# EAGLE design RH030.2 (EAGLE 7.1.0)
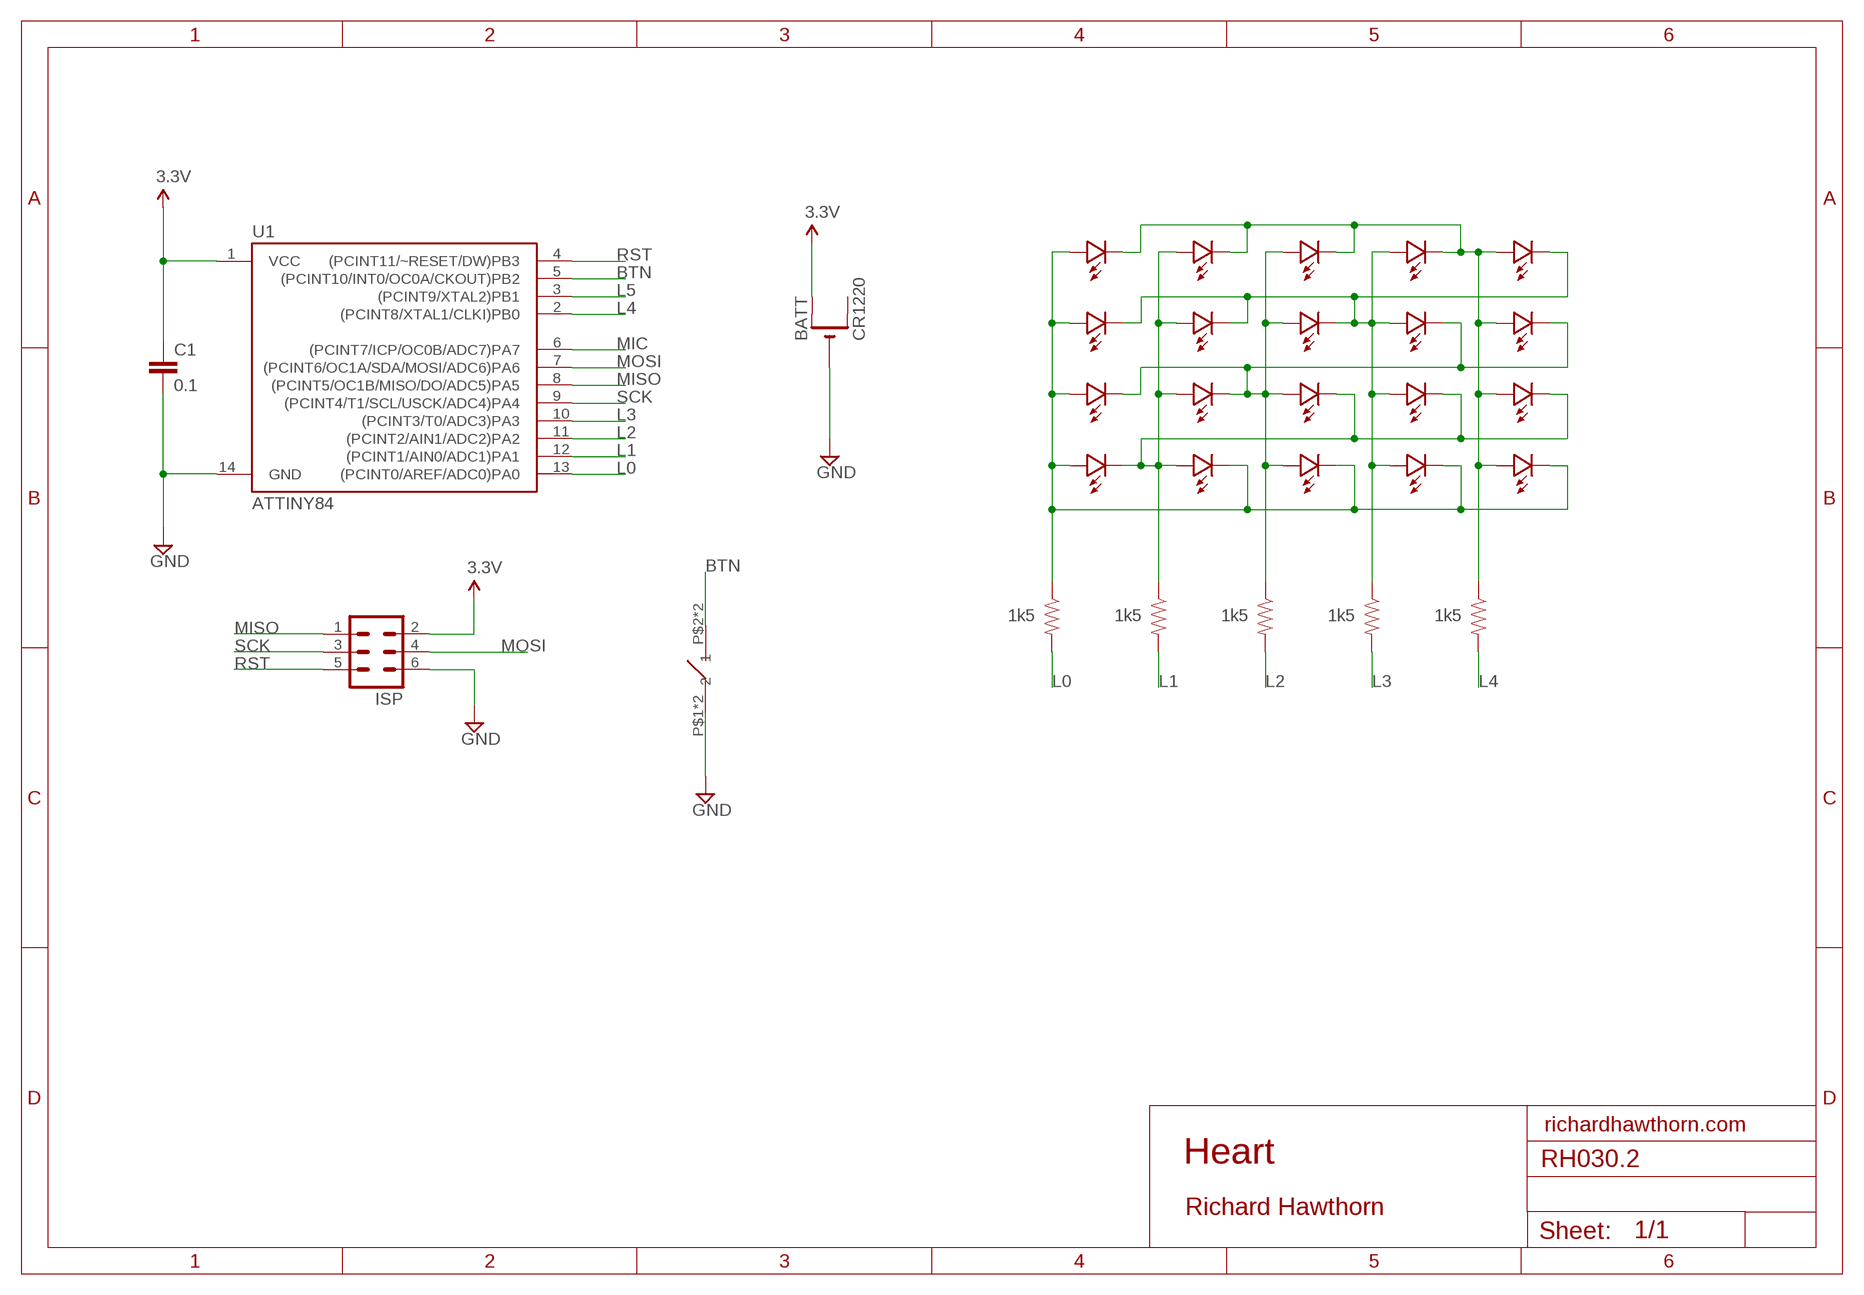
[diagram p0: schematic, sheet 1]

## Parts
BATT  CR1220  CR1220SMT  [CR1220-SMD]
BTN1  TURTLE-3PIN  [TURTLE-3PIN]
C1  0.1  CAP0603-CAP  [0603-CAP]
ISP  MA03-2  [MA03-2]
LED1  LED0603  [0603-LED]
LED2  LED0603  [0603-LED]
LED3  LED0603  [0603-LED]
LED4  LED0603  [0603-LED]
LED5  LED0603  [0603-LED]
LED6  LED0603  [0603-LED]
LED7  LED0603  [0603-LED]
LED8  LED0603  [0603-LED]
LED9  LED0603  [0603-LED]
LED10  LED0603  [0603-LED]
LED11  LED0603  [0603-LED]
LED12  LED0603  [0603-LED]
LED13  LED0603  [0603-LED]
LED14  LED0603  [0603-LED]
LED15  LED0603  [0603-LED]
LED16  LED0603  [0603-LED]
LED17  LED0603  [0603-LED]
LED18  LED0603  [0603-LED]
LED19  LED0603  [0603-LED]
LED20  LED0603  [0603-LED]
R1  1k5  RESISTOR0603-RES  [0603-RES]
R2  1k5  RESISTOR0603-RES  [0603-RES]
R3  1k5  RESISTOR0603-RES  [0603-RES]
R4  1k5  RESISTOR0603-RES  [0603-RES]
R5  1k5  RESISTOR0603-RES  [0603-RES]
U1  ATTINY84  [SO14]

## Nets
BTN: BTN1.P$2 BTN1.P$4 U1.5((PCINT10/INT0/OC0A/CKOUT)PB2)
GND [power]: BATT.- BTN1.P$1 BTN1.P$3 C1.2 ISP.6 U1.14(GND)
L0: R1.2 U1.13((PCINT0/AREF/ADC0)PA0)
L1: R2.2 U1.12((PCINT1/AIN0/ADC1)PA1)
L2: R3.2 U1.11((PCINT2/AIN1/ADC2)PA2)
L3: R4.2 U1.10((PCINT3/T0/ADC3)PA3)
L4: R5.2 U1.2((PCINT8/XTAL1/CLKI)PB0)
L5: U1.3((PCINT9/XTAL2)PB1)
MIC: U1.6((PCINT7/ICP/OC0B/ADC7)PA7)
MISO: ISP.1 U1.8((PCINT5/OC1B/MISO/DO/ADC5)PA5)
MOSI: ISP.4 U1.7((PCINT6/OC1A/SDA/MOSI/ADC6)PA6)
N$12: LED2.PLUS LED7.PLUS LED12.PLUS LED13.MINUS LED14.MINUS LED15.MINUS LED16.MINUS LED17.PLUS R2.1
N$22: LED1.PLUS LED6.PLUS LED11.PLUS LED16.PLUS LED17.MINUS LED18.MINUS LED19.MINUS LED20.MINUS R1.1
N$32: LED1.MINUS LED2.MINUS LED3.MINUS LED4.MINUS LED5.PLUS LED10.PLUS LED15.PLUS LED20.PLUS R5.1
N$41: LED4.PLUS LED5.MINUS LED6.MINUS LED7.MINUS LED8.MINUS LED9.PLUS LED14.PLUS LED19.PLUS R4.1
N$50: LED3.PLUS LED8.PLUS LED9.MINUS LED10.MINUS LED11.MINUS LED12.MINUS LED13.PLUS LED18.PLUS R3.1
RST: ISP.5 U1.4((PCINT11/~RESET/DW)PB3)
SCK: ISP.3 U1.9((PCINT4/T1/SCL/USCK/ADC4)PA4)
VCC: BATT.+$1(+) C1.1 ISP.2 U1.1(VCC) ; supply symbol labelled 3.3V
Unconnected: BATT.+$2(+1)

## Notes on the sheet
- richardhawthorn.com
- Heart
- Richard Hawthorn

## Library data of the parts
BATT = adafruit:CR1220: CR1216/CR1220/CR1225 12mm 3V lithium coin cell Great for battery packup. Both SMT and THM holders. Note the THM package has the ground pads on both sides of the PCB so that the masks are the same - this reduces the cost
BTN1 = Richards:TURTLE-3PIN
C1 = LowPowerLab:CAP: Capacitor Standard 0603 ceramic capacitor, and 0.1" leaded capacitor.
ISP = Richards:MA03-2: PIN HEADER; OC_FARNELL: unknown; OC_NEWARK: unknown
LED1-LED20 = LowPowerLab:LED
R1-R5 = LowPowerLab:RESISTOR: Resistor Basic schematic elements and footprints for 0603, 1206, and PTH resistors.
U1 = SparkFun-DigitalIC:ATTINY84: Atmel 14-pin 2/4/8kB flash uC

## Net classes
1 power: width 0.381 mm, clearance 0.254 mm

## Board
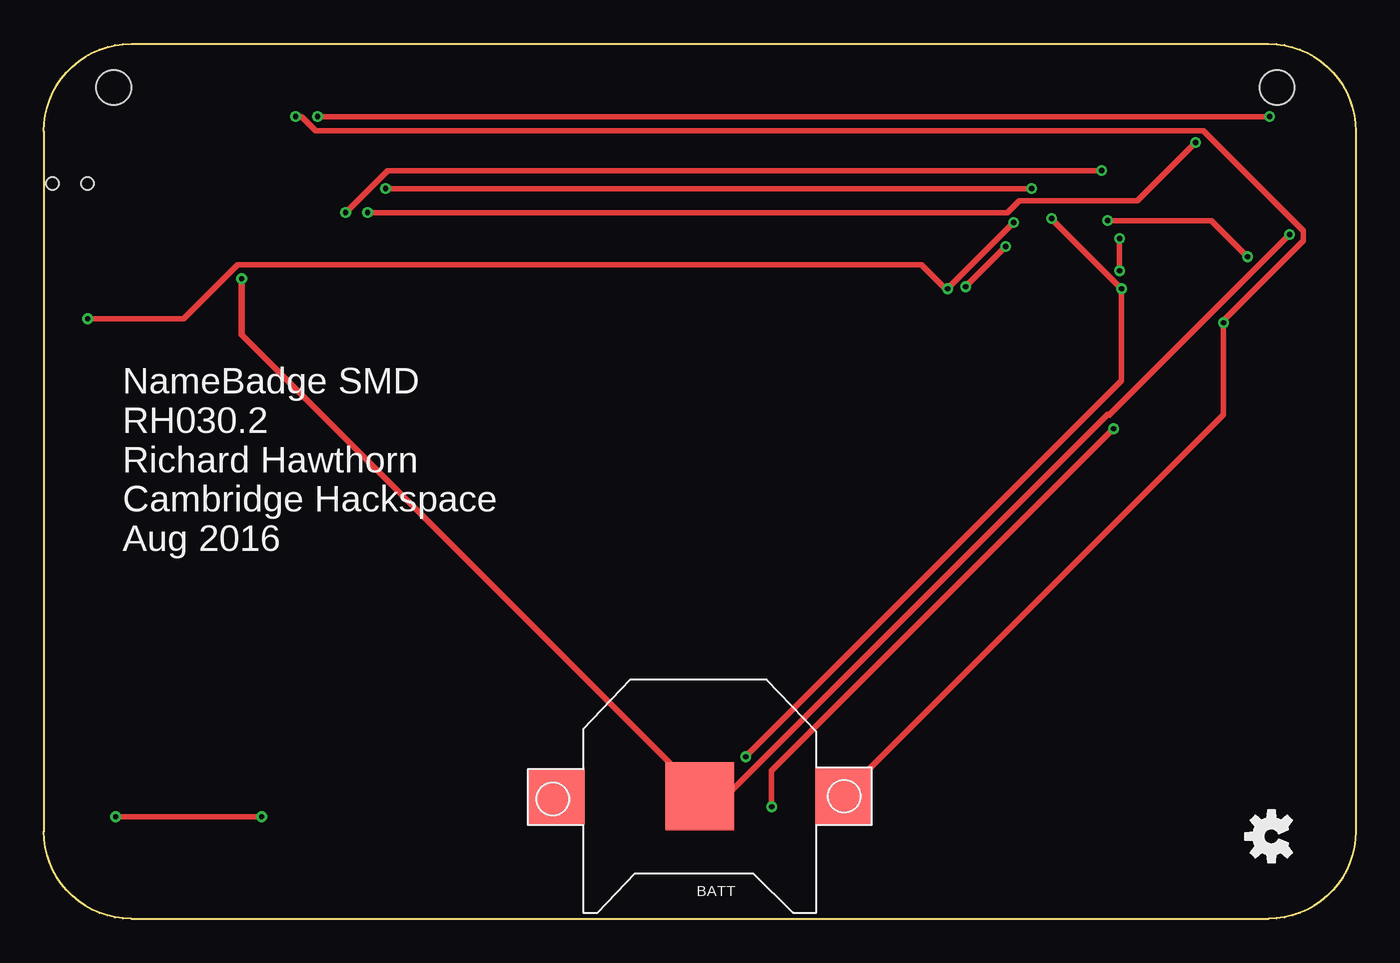
[diagram p1: board, top side]
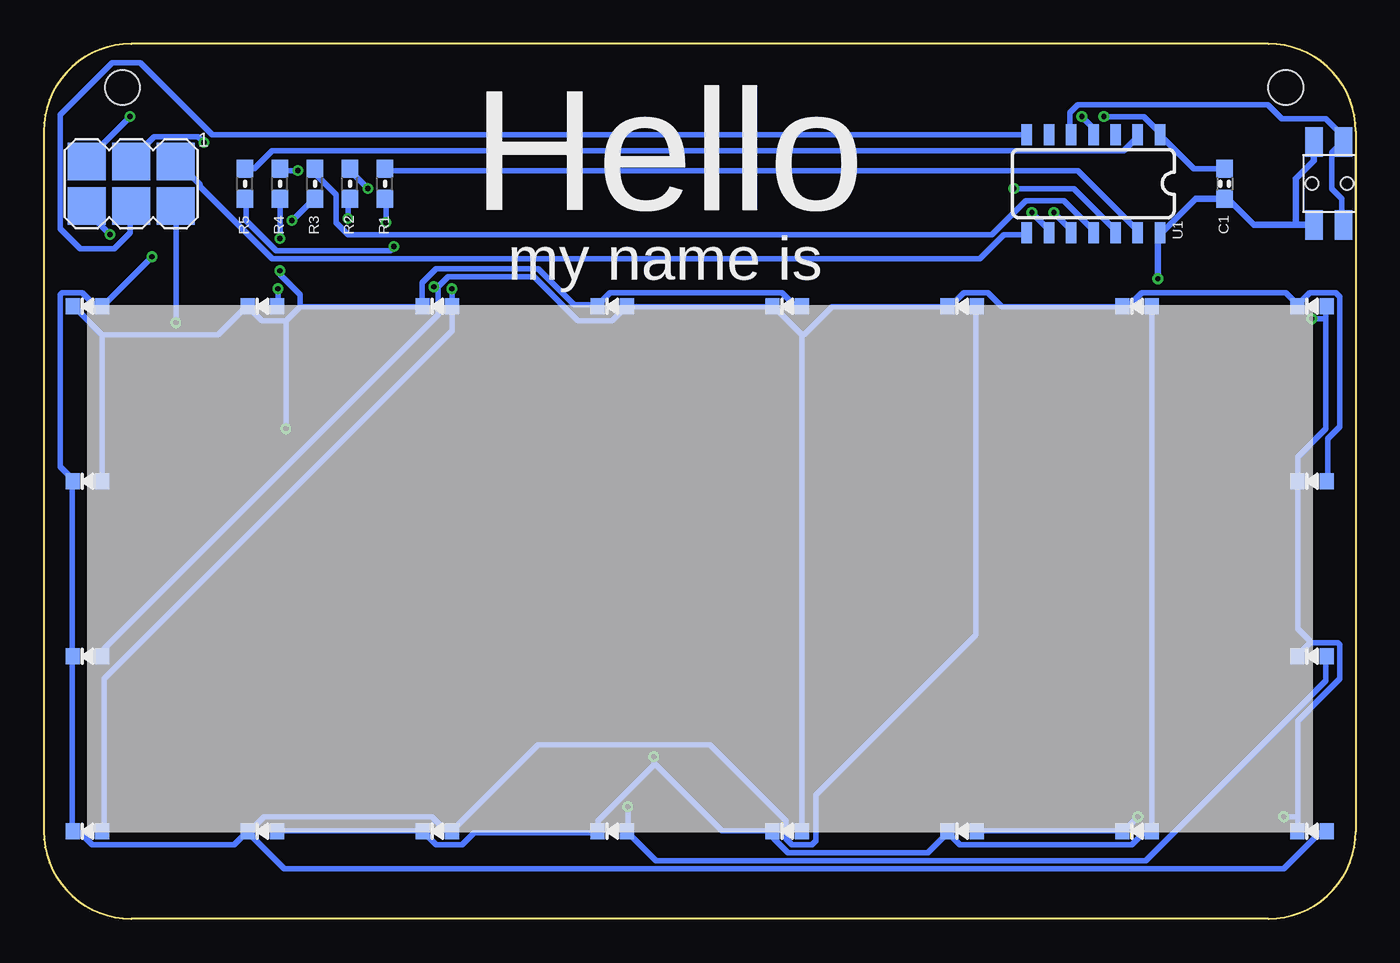
[diagram p2: board, bottom side, seen from below]

Size 75 x 50 mm. Coordinates in mm from the lower left corner, seen from the top.
Outline: 5,50 70,50 arc-90 75,45 75,5 arc-90 70,0 5,0 arc-90 0,5 0,45 arc-90 5,50
Copper layers (1*16): Top 0.035mm / dielectric 1.5mm / Bottom 0.035mm
Design rules "ITEADstudio_DRC *": minimum track width 12mil, minimum drill 12mil, track to track 6mil, track to pad 6mil, pad to pad 6mil, via to via 6mil, smd to smd 0mil, copper to edge 10mil, drill to drill 10mil, minimum pad ring 10mil, minimum via ring 6mil, stop-mask expansion 2mil, vias tented up to drill 100mil, thermal gap 15mil
Holes 2 mm at 4,47.5 70.5,47.5
tRestrict: area 24.3,8.9 to 29.1,12.8; area 5.8,16.9 to 6.9,18.5; area 5.2,9.7 to 6.7,10.4
bRestrict: area 27.4,17.7 to 29.2,18.7; area 21.1,13.8 to 22.9,14.9; area 21.6,12.6 to 22.1,13.2; area 20.7,12.6 to 21.2,13.2; area 20.2,12.8 to 20.7,13.5; area 20.1,13.4 to 20.6,14; area 26.5,18.9 to 27.1,19.5; area 26.5,17.9 to 27.1,18.5; area 27.5,19.1 to 28,19.8; area 27.9,18.8 to 29.1,19.6

### Footprints (pad centres in the part's own frame; a part is rotated, then mirrored left to right if it is on the bottom)
CR1220-SMD = smd 3.2 x 3.2: +$1 -8.2,0; +$2 8.2,0 | smd 3.9 x 3.9: - 0,0
TURTLE-3PIN = smd 1.676 x 1: P$1 -2.39,-0.889; P$2 -2.39,0.811; P$3 2.36,-0.889; P$4 2.36,0.811 | hole 0.75: -0.015,-1; -0.015,1
0603-CAP = smd 1.016 x 0.965: 1 -0.85,0; 2 0.85,0
MA03-2 = smd 2.159 x 2.159: 1 -2.54,-1.27; 2 -2.54,1.27; 3 0,-1.27; 4 0,1.27; 5 2.54,-1.27; 6 2.54,1.27
0603-LED = smd 0.8 x 0.9: MINUS -0.85,0; PLUS 0.85,0
0603-RES = smd 1.016 x 0.965: 1 -0.85,0; 2 0.85,0
SO14 = smd 0.6 x 1.2: 1 -3.81,-2.8; 2 -2.54,-2.8; 3 -1.27,-2.8; 4 0,-2.8; 5 1.27,-2.8; 6 2.54,-2.8; 7 3.81,-2.8; 8 3.81,2.8; 9 2.54,2.8; 10 1.27,2.8; 11 0,2.8; 12 -1.27,2.8; 13 -2.54,2.8; 14 -3.81,2.8

### Placement (x,y rotation side)
BATT  37.5,7 180 top
BTN1  1.5,42 270 bottom
C1  7.5,42 270 bottom
ISP  70,42 180 bottom
LED1  2.5,35 0 bottom
LED2  12.5,35 0 bottom
LED3  22.5,35 0 bottom
LED4  32.5,35 0 bottom
LED5  42.5,35 0 bottom
LED6  52.5,35 0 bottom
LED7  62.5,35 0 bottom
LED8  72.5,35 0 bottom
LED9  72.5,25 0 bottom
LED10  72.5,15 0 bottom
LED11  72.5,5 0 bottom
LED12  62.5,5 0 bottom
LED13  52.5,5 0 bottom
LED14  42.5,5 0 bottom
LED15  32.5,5 0 bottom
LED16  22.5,5 0 bottom
LED17  12.5,5 0 bottom
LED18  2.5,5 0 bottom
LED19  2.5,15 0 bottom
LED20  2.5,25 0 bottom
R1  55.5,42 90 bottom
R2  57.5,42 90 bottom
R3  59.5,42 90 bottom
R4  61.5,42 90 bottom
R5  63.5,42 90 bottom
U1  15,42 180 bottom
U$3  [OSHW-LOGO-S]  70.17,4.71 90 top

### Tracks (layer width: path | path; a pad name or v marks a point on that pad's centre or on a via)
BTN
  Bottom 0.305: BTN1.P$4 0.8,39.66 0.8,41.15 1.37,41.72 1.37,43.78 0.8,44.35 BTN1.P$2 0.91,44.46 0.91,44.92 1.71,45.72 4.23,45.72 5.03,46.52 15.89,46.52 16.34,46.06 16.34,44.81 U1.5
GND  (via drill 0.3)
  Top 0.381: v71.21,39.09 60.92,28.8 60.81,28.8 39.09,7.09 37.6,7.09 BATT.- 37.49,7.2 11.32,33.38 v11.32,36.58
  Bottom 0.381: 3.43,39.66 5.83,39.66 7.32,41.15 C1.2 7.54,41.15 9.14,41.15 11.09,39.2 U1.14 11.32,39.09 v11.32,36.58 | 3.43,39.66 2.4,39.66 BTN1.P$3 | 3.43,39.66 3.43,42.29 2.4,43.32 2.4,44.35 BTN1.P$1 | v71.21,39.09 72.47,40.35 72.47,40.69 ISP.6
L0
  Bottom 0.305: R1.2 55.44,42.75 15.89,42.75 12.57,39.43 12.57,39.2 U1.13
L1  (via drill 0.3)
  Top 0.305: v19.55,41.72 v56.46,41.72
  Bottom 0.305: v56.46,41.72 57.49,42.75 R2.2 | v19.55,41.72 16.12,41.72 13.83,39.43 13.83,39.2 U1.12
L2
  Bottom 0.305: R3.2 59.44,42.75 59.44,42.52 58.29,41.38 58.29,39.78 57.61,39.09 20.8,39.09 18.86,41.03 16.69,41.03 15.09,39.43 15.09,39.2 U1.11
L3  (via drill 0.3)
  Top 0.305: v60.47,42.75 19.66,42.75 v17.26,40.35
  Bottom 0.305: v60.47,42.75 61.49,42.75 R4.2 | v17.26,40.35 16.34,39.43 16.34,39.2 U1.10
L4
  Bottom 0.305: R5.2 63.44,42.86 62.98,42.86 61.95,43.89 13.26,43.89 12.46,44.69 U1.2
MISO
  Bottom 0.305: U1.8 18.86,39.09 20.12,39.09 21.49,37.72 61.95,37.72 66.06,41.83 66.06,41.95 67.44,43.32 ISP.1
MOSI
  Bottom 0.305: U1.7 18.86,44.81 65.38,44.81 69.49,48.92 71.09,48.92 74.07,45.95 74.07,39.43 72.92,38.29 70.98,38.29 70.07,39.2 70.07,40.69 ISP.4
N$12  (via drill 0.3)
  Top 0.305: v57.61,40.01 v61.61,36.01 61.61,30.75 v40.12,9.26
  Bottom 0.305: LED2.PLUS 11.66,34.98 11.66,5.14 LED17.PLUS 11.66,4.92 12.12,4.92 12.8,4.23 22.63,4.23 23.32,4.92 LED16.MINUS 23.43,4.8 24.46,3.77 32.46,3.77 33.26,4.57 33.26,4.92 LED15.MINUS 33.49,5.03 36.23,5.03 40.01,8.8 40.12,8.8 | v61.61,36.01 61.61,35.09 LED7.PLUS | v57.61,40.01 57.61,41.15 R2.1 | LED12.PLUS 61.61,5.03 53.49,5.03 LED13.MINUS 53.26,4.92 52.58,4.23 51.09,4.23 50.41,4.92 43.43,4.92 LED14.MINUS 43.32,5.14 43.32,5.6 40.12,8.8 | 40.12,8.8 v40.12,9.26
N$22  (via drill 0.3)
  Top 0.305: v4.12,5.83 v12.46,5.83 | v55.44,39.78 v51.66,36.01 51.55,36.01 50.18,37.38 11.09,37.38 8,34.29 v2.52,34.29
  Bottom 0.305: LED16.PLUS 21.6,5.03 13.37,5.03 LED17.MINUS 13.26,5.03 v12.46,5.83 | 3.31,5.83 3.31,11.32 0.91,13.72 0.91,15.66 1.03,15.77 2.63,15.77 | 3.31,5.83 3.31,5.03 LED18.MINUS | 2.63,15.77 3.31,15.09 LED19.MINUS | 2.63,15.77 2.63,15.89 3.31,16.57 3.31,24.92 LED20.MINUS 3.31,25.15 3.31,26.4 1.71,28 1.71,34.29 | 1.71,34.29 1.71,34.98 LED1.PLUS | 3.31,5.83 v4.12,5.83 | LED11.PLUS 71.55,5.03 71.55,13.72 51.66,33.6 51.66,34.98 LED6.PLUS 51.66,35.09 v51.66,36.01 | v55.44,39.78 55.44,41.15 R1.1 | v2.52,34.29 1.71,34.29
N$32  (via drill 0.3)
  Top 0.305: v52.69,36.12 v54.98,38.41
  Bottom 0.305: LED20.PLUS 1.6,25.03 1.6,27.43 0.91,28.12 0.91,35.55 1.14,35.78 2.63,35.78 3.31,35.09 LED1.MINUS 3.43,35.2 4,35.78 12.23,35.78 12.92,35.09 13.26,35.09 LED2.MINUS 13.49,34.98 20.23,34.98 21.03,35.78 22.4,35.78 23.2,34.98 LED3.MINUS 23.43,34.98 29.95,34.98 31.55,33.38 31.66,33.38 | 31.66,33.38 31.66,5.03 LED15.PLUS | 31.66,33.38 33.26,34.98 LED4.MINUS 33.49,34.98 41.6,34.98 LED5.PLUS 41.72,34.98 42.52,34.18 44.46,34.18 46.98,36.69 51.89,36.69 52.46,36.12 | 52.46,36.12 52.46,34.52 71.55,15.43 71.55,15.09 LED10.PLUS | v54.98,38.41 55.21,38.18 61.72,38.18 63.44,39.89 63.44,41.15 R5.1 | v52.69,36.12 52.46,36.12
N$41  (via drill 0.3)
  Top 0.305: v61.49,37.03 v61.49,38.86 | v41.6,6.4 41.6,8.46 v61.15,28
  Bottom 0.305: LED19.PLUS 1.71,14.97 1.71,13.6 12,3.31 40.01,3.31 41.6,4.92 LED14.PLUS 41.6,5.14 v41.6,6.4 | LED4.PLUS 31.66,35.09 32.12,35.09 32.8,35.78 42.63,35.78 43.32,35.09 LED5.MINUS 43.43,35.09 44.69,35.09 46.75,37.15 52.58,37.15 53.38,36.35 53.38,35.09 LED6.MINUS 53.38,34.98 60.35,34.98 | 71.67,33.38 71.67,25.03 LED9.PLUS | 71.67,33.38 73.27,34.98 LED8.MINUS | 61.15,34.18 60.35,34.98 | 61.15,34.18 62.52,34.18 63.32,34.98 LED7.MINUS 63.44,34.98 65.04,33.38 71.67,33.38 | v61.49,38.86 R4.1 | v61.49,37.03 61.49,36.8 60.35,35.66 60.35,34.98 | 61.15,34.18 v61.15,28
N$50  (via drill 0.3)
  Top 0.305: v60.81,39.89 66.75,39.89 v68.81,37.83
  Bottom 0.305: v60.81,39.89 59.55,41.15 R3.1 | v68.81,37.83 71.55,35.09 LED8.PLUS 71.67,35.09 72.12,35.09 72.81,35.78 73.95,35.78 74.07,35.66 74.07,25.83 73.38,25.15 LED9.MINUS 73.38,24.92 73.38,15.09 LED10.MINUS 73.38,14.97 73.38,5.03 LED11.MINUS 73.27,4.92 72.92,4.92 72.24,4.23 64.12,4.23 63.44,4.92 LED12.MINUS | LED18.PLUS 1.71,4.92 2.06,4.92 4.12,2.86 61.27,2.86 63.32,4.92 LED12.MINUS | LED12.MINUS 63.21,5.03 62.41,5.83 52.81,5.83 52.01,5.03 51.66,5.03 LED13.PLUS 51.55,5.14 46.75,9.94 36.92,9.94 32.58,5.6 32.58,4.57 32.23,4.23 31.09,4.23 30.86,4.46 30.86,7.09 21.72,16.23 21.72,34.98 LED3.PLUS
RST  (via drill 0.3)
  Top 0.305: v70.07,45.83 v15.66,45.83
  Bottom 0.305: v15.66,45.83 15.09,45.26 15.09,44.81 U1.4 | v70.07,45.83 72.58,43.32 ISP.5
SCK  (via drill 0.3)
  Top 0.305: v18.52,40.35 55.09,40.35 55.78,41.03 62.52,41.03 v65.84,44.35
  Bottom 0.305: v18.52,40.35 17.6,39.43 17.6,39.2 U1.9 | v65.84,44.35 66.18,44.69 68.69,44.69 70.07,43.32 ISP.3
VCC  (via drill 0.3)
  Top 0.305: BATT.+$1 45.72,7.09 67.44,28.8 v67.44,34.06 67.44,34.18 72.01,38.75 72.01,39.32 66.29,45.03 15.54,45.03 14.74,45.83 v14.4,45.83
  Bottom 0.305: C1.1 7.54,42.86 9.26,42.86 11.09,44.69 U1.1 11.2,44.92 12.12,45.83 v14.4,45.83 | v67.44,34.06 67.44,40.69 ISP.2

### Text on the board
tNames: NameBadge SMD / RH030.2 / Richard Hawthorn / Cambridge Hackspace / Aug 2016
bNames: Hello | my name is
tDocu: REG